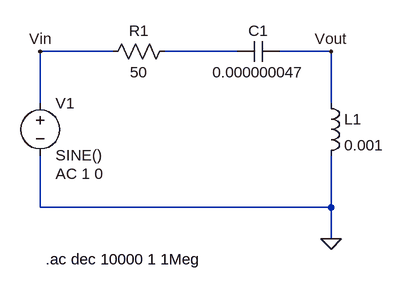
[diagram p0: schematic Pasa_Altos.asc]
Pasa_Altos.asc, the LTspice schematic file:
Version 4
SHEET 1 880 680
WIRE 160 16 48 16
WIRE 352 16 240 16
WIRE 496 16 416 16
WIRE 48 96 48 16
WIRE 496 96 496 16
WIRE 48 256 48 176
WIRE 496 256 496 176
WIRE 496 256 48 256
WIRE 496 304 496 256
FLAG 496 304 0
FLAG 48 16 Vin
FLAG 496 16 Vout
SYMBOL voltage 48 80 R0
WINDOW 123 24 124 Left 2
WINDOW 39 0 0 Left 0
SYMATTR InstName V1
SYMATTR Value SINE()
SYMATTR Value2 AC 1 0
SYMBOL res 256 0 R90
WINDOW 0 0 56 VBottom 2
WINDOW 3 32 56 VTop 2
SYMATTR InstName R1
SYMATTR Value 50
SYMBOL cap 416 0 R90
WINDOW 0 0 32 VBottom 2
WINDOW 3 32 32 VTop 2
SYMATTR InstName C1
SYMATTR Value 0.000000047
SYMBOL ind 480 80 R0
SYMATTR InstName L1
SYMATTR Value 0.001
TEXT 56 336 Left 2 !.ac dec 10000 1 1Meg

The netlist it stands for:
* Pasa_Altos.asc
V1 Vin 0 SINE() AC 1 0
R1 N001 Vin 50
C1 Vout N001 0.000000047
L1 Vout 0 0.001
.ac dec 10000 1 1Meg
.backanno
.end